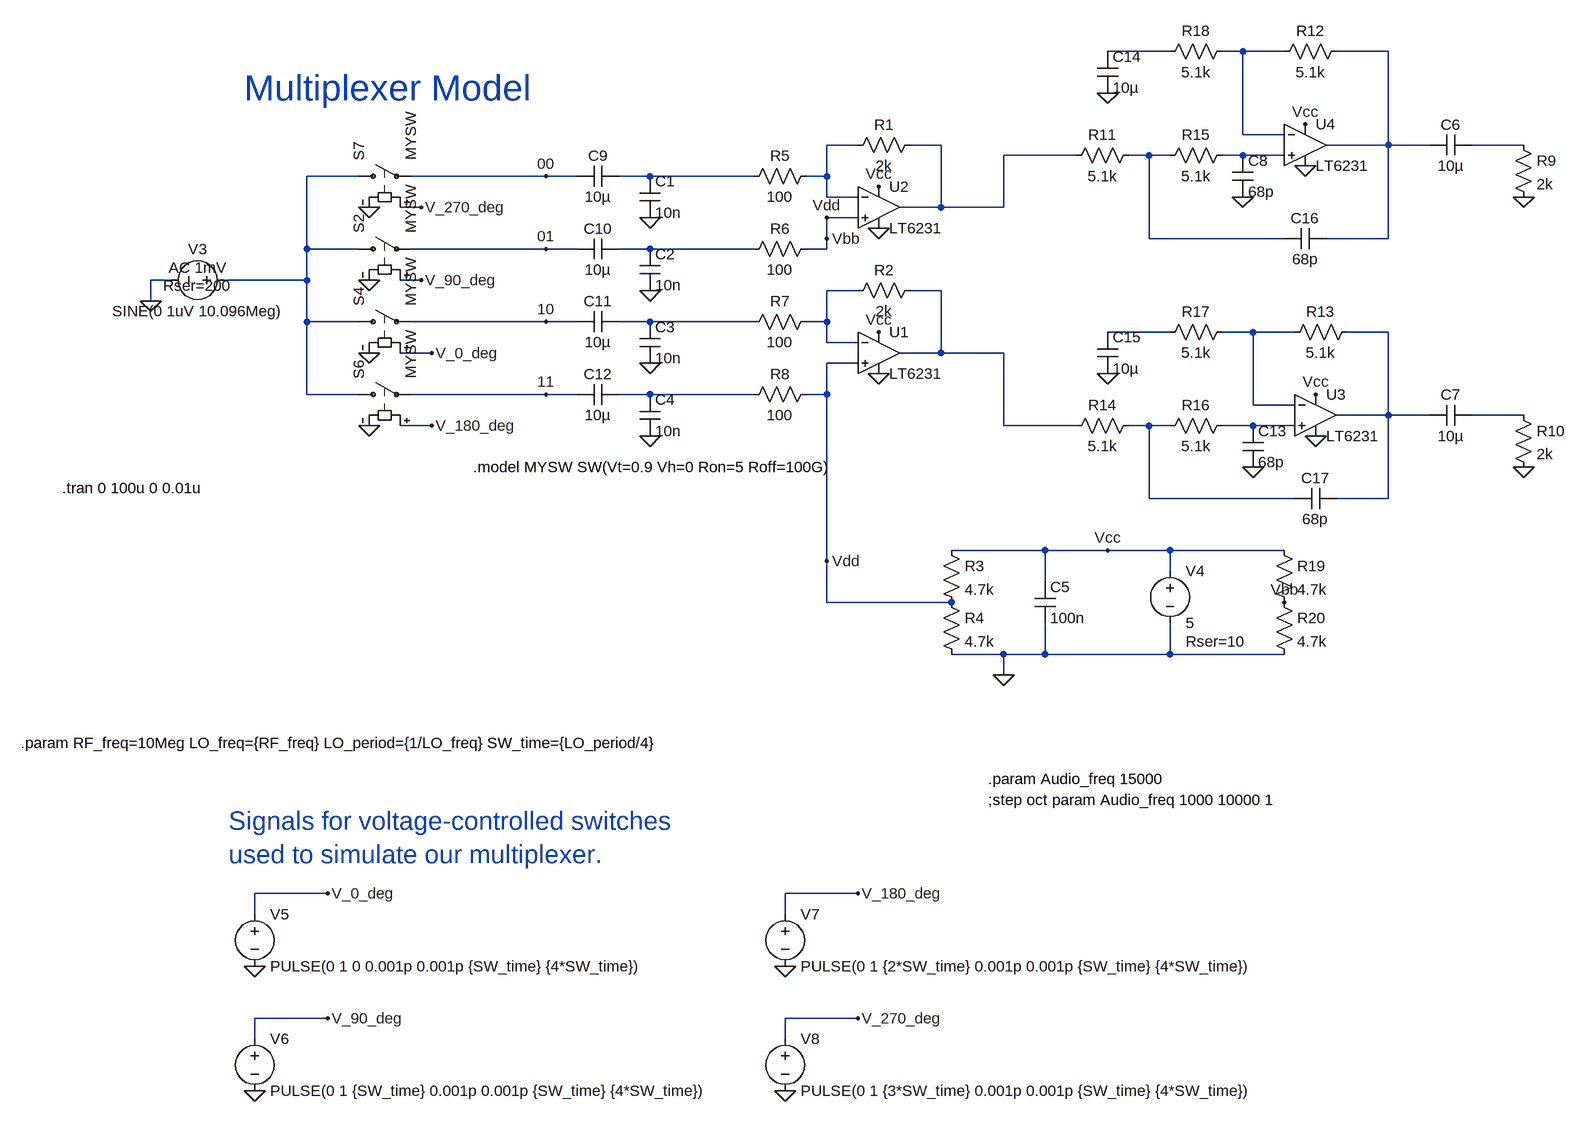
[diagram p0: schematic MUXModel_2.asc]
MUXModel_2.asc, the LTspice schematic file:
Version 4
SHEET 1 2640 932
WIRE 1376 -688 1280 -688
WIRE 1488 -688 1456 -688
WIRE 1552 -688 1488 -688
WIRE 1712 -688 1632 -688
WIRE 1488 -560 1488 -688
WIRE 1552 -560 1488 -560
WIRE 896 -544 848 -544
WIRE 1024 -544 976 -544
WIRE 1712 -544 1712 -688
WIRE 1712 -544 1616 -544
WIRE 1776 -544 1712 -544
WIRE 1920 -544 1840 -544
WIRE 1232 -528 1120 -528
WIRE 1344 -528 1312 -528
WIRE 1376 -528 1344 -528
WIRE 1488 -528 1456 -528
WIRE 1552 -528 1488 -528
WIRE 128 -496 48 -496
WIRE 416 -496 208 -496
WIRE 464 -496 416 -496
WIRE 576 -496 528 -496
WIRE 736 -496 576 -496
WIRE 848 -496 848 -544
WIRE 848 -496 816 -496
WIRE 848 -464 848 -496
WIRE 896 -464 848 -464
WIRE 224 -448 192 -448
WIRE 1024 -448 1024 -544
WIRE 1024 -448 960 -448
WIRE 1120 -448 1120 -528
WIRE 1120 -448 1024 -448
WIRE 896 -432 848 -432
WIRE 848 -400 848 -432
WIRE 1344 -400 1344 -528
WIRE 1552 -400 1344 -400
WIRE 1712 -400 1712 -544
WIRE 1712 -400 1616 -400
WIRE 48 -384 48 -496
WIRE 128 -384 48 -384
WIRE 416 -384 208 -384
WIRE 464 -384 416 -384
WIRE 576 -384 528 -384
WIRE 736 -384 576 -384
WIRE 848 -384 848 -400
WIRE 848 -384 816 -384
WIRE -160 -336 -192 -336
WIRE 48 -336 48 -384
WIRE 48 -336 -80 -336
WIRE 224 -336 192 -336
WIRE 896 -320 848 -320
WIRE 1024 -320 976 -320
WIRE -192 -304 -192 -336
WIRE 48 -272 48 -336
WIRE 128 -272 48 -272
WIRE 416 -272 208 -272
WIRE 464 -272 416 -272
WIRE 576 -272 528 -272
WIRE 736 -272 576 -272
WIRE 848 -272 848 -320
WIRE 848 -272 816 -272
WIRE 1376 -256 1280 -256
WIRE 1504 -256 1456 -256
WIRE 1568 -256 1504 -256
WIRE 1712 -256 1648 -256
WIRE 848 -240 848 -272
WIRE 896 -240 848 -240
WIRE 240 -224 192 -224
WIRE 1024 -224 1024 -320
WIRE 1024 -224 960 -224
WIRE 1120 -224 1024 -224
WIRE 896 -208 848 -208
WIRE 48 -160 48 -272
WIRE 128 -160 48 -160
WIRE 416 -160 208 -160
WIRE 464 -160 416 -160
WIRE 576 -160 528 -160
WIRE 736 -160 576 -160
WIRE 848 -160 848 -208
WIRE 848 -160 816 -160
WIRE 1504 -144 1504 -256
WIRE 1568 -144 1504 -144
WIRE 1712 -128 1712 -256
WIRE 1712 -128 1632 -128
WIRE 1776 -128 1712 -128
WIRE 1920 -128 1840 -128
WIRE 240 -112 192 -112
WIRE 1120 -112 1120 -224
WIRE 1232 -112 1120 -112
WIRE 1344 -112 1312 -112
WIRE 1376 -112 1344 -112
WIRE 1504 -112 1456 -112
WIRE 1568 -112 1504 -112
WIRE 1344 0 1344 -112
WIRE 1568 0 1344 0
WIRE 1712 0 1712 -128
WIRE 1712 0 1632 0
WIRE 1184 80 1040 80
WIRE 1280 80 1184 80
WIRE 1376 80 1280 80
WIRE 1552 80 1376 80
WIRE 848 96 848 -160
WIRE 1376 112 1376 80
WIRE 1184 128 1184 80
WIRE 848 160 848 96
WIRE 1040 160 848 160
WIRE 1120 240 1040 240
WIRE 1184 240 1184 192
WIRE 1184 240 1120 240
WIRE 1376 240 1376 192
WIRE 1376 240 1184 240
WIRE 1552 240 1376 240
WIRE 1120 272 1120 240
WIRE 80 608 -32 608
WIRE 896 608 784 608
WIRE -32 640 -32 608
WIRE 784 640 784 608
WIRE 80 800 -32 800
WIRE 896 800 784 800
WIRE -32 832 -32 800
WIRE 784 832 784 800
FLAG 144 -448 0
FLAG 144 -336 0
FLAG 144 -224 0
FLAG 144 -112 0
FLAG -192 -304 0
FLAG 416 -496 00
FLAG 416 -384 01
FLAG 416 -160 11
FLAG 416 -272 10
FLAG 576 -432 0
FLAG 576 -320 0
FLAG 576 -208 0
FLAG 576 -96 0
FLAG 928 -416 0
FLAG 928 -192 0
FLAG 1120 272 0
FLAG 1280 80 Vcc
FLAG 928 -256 Vcc
FLAG 928 -480 Vcc
FLAG 848 96 Vdd
FLAG 848 -432 Vdd
FLAG 1584 -512 0
FLAG 1600 -96 0
FLAG 1584 -576 Vcc
FLAG 1600 -160 Vcc
FLAG 1504 -48 0
FLAG 1488 -464 0
FLAG 1280 -192 0
FLAG 1280 -624 0
FLAG 1920 -48 0
FLAG 1920 -464 0
FLAG -32 720 0
FLAG 80 608 V_0_deg
FLAG -32 912 0
FLAG 80 800 V_90_deg
FLAG 784 720 0
FLAG 896 608 V_180_deg
FLAG 784 912 0
FLAG 896 800 V_270_deg
FLAG 240 -112 V_180_deg
FLAG 240 -224 V_0_deg
FLAG 224 -336 V_90_deg
FLAG 224 -448 V_270_deg
FLAG 1552 160 Vbb
FLAG 848 -400 Vbb
SYMBOL sw 112 -496 R270
SYMATTR InstName S7
SYMATTR Value MYSW
SYMBOL sw 112 -384 R270
SYMATTR InstName S2
SYMATTR Value MYSW
SYMBOL sw 112 -272 R270
SYMATTR InstName S4
SYMATTR Value MYSW
SYMBOL sw 112 -160 R270
SYMATTR InstName S6
SYMATTR Value MYSW
SYMBOL voltage -64 -336 R90
WINDOW 0 -32 56 VBottom 2
WINDOW 3 32 56 VTop 2
WINDOW 123 -4 56 VBottom 2
WINDOW 39 24 56 VBottom 2
SYMATTR InstName V3
SYMATTR Value SINE(0 1uV 10.096Meg)
SYMATTR Value2 AC 1mV
SYMATTR SpiceLine Rser=200
SYMBOL cap 560 -496 R0
SYMATTR InstName C1
SYMATTR Value 10n
SYMBOL cap 560 -384 R0
SYMATTR InstName C2
SYMATTR Value 10n
SYMBOL cap 560 -272 R0
SYMATTR InstName C3
SYMATTR Value 10n
SYMBOL cap 560 -160 R0
SYMATTR InstName C4
SYMATTR Value 10n
SYMBOL res 832 -512 R90
WINDOW 0 0 56 VBottom 2
WINDOW 3 32 56 VTop 2
SYMATTR InstName R5
SYMATTR Value 100
SYMBOL res 832 -400 R90
WINDOW 0 0 56 VBottom 2
WINDOW 3 32 56 VTop 2
SYMATTR InstName R6
SYMATTR Value 100
SYMBOL res 832 -288 R90
WINDOW 0 0 56 VBottom 2
WINDOW 3 32 56 VTop 2
SYMATTR InstName R7
SYMATTR Value 100
SYMBOL res 832 -176 R90
WINDOW 0 0 56 VBottom 2
WINDOW 3 32 56 VTop 2
SYMATTR InstName R8
SYMATTR Value 100
SYMBOL cap 528 -512 R90
WINDOW 0 0 32 VBottom 2
WINDOW 3 32 32 VTop 2
SYMATTR InstName C9
SYMATTR Value 10µ
SYMBOL cap 528 -400 R90
WINDOW 0 0 32 VBottom 2
WINDOW 3 32 32 VTop 2
SYMATTR InstName C10
SYMATTR Value 10µ
SYMBOL cap 528 -288 R90
WINDOW 0 0 32 VBottom 2
WINDOW 3 32 32 VTop 2
SYMATTR InstName C11
SYMATTR Value 10µ
SYMBOL cap 528 -176 R90
WINDOW 0 0 32 VBottom 2
WINDOW 3 32 32 VTop 2
SYMATTR InstName C12
SYMATTR Value 10µ
SYMBOL res 992 -560 R90
WINDOW 0 0 56 VBottom 2
WINDOW 3 32 56 VTop 2
SYMATTR InstName R1
SYMATTR Value 2k
SYMBOL res 992 -336 R90
WINDOW 0 0 56 VBottom 2
WINDOW 3 32 56 VTop 2
SYMATTR InstName R2
SYMATTR Value 2k
SYMBOL res 1024 64 R0
SYMATTR InstName R3
SYMATTR Value 4.7k
SYMBOL res 1024 144 R0
SYMATTR InstName R4
SYMATTR Value 4.7k
SYMBOL cap 1168 128 R0
SYMATTR InstName C5
SYMATTR Value 100n
SYMBOL voltage 1376 96 R0
WINDOW 123 0 0 Left 0
WINDOW 39 24 124 Left 2
SYMATTR SpiceLine Rser=10
SYMATTR InstName V4
SYMATTR Value 5
SYMBOL res 1328 -544 R90
WINDOW 0 0 56 VBottom 2
WINDOW 3 32 56 VTop 2
SYMATTR InstName R11
SYMATTR Value 5.1k
SYMBOL res 1648 -704 R90
WINDOW 0 0 56 VBottom 2
WINDOW 3 32 56 VTop 2
SYMATTR InstName R12
SYMATTR Value 5.1k
SYMBOL res 1664 -272 R90
WINDOW 0 0 56 VBottom 2
WINDOW 3 32 56 VTop 2
SYMATTR InstName R13
SYMATTR Value 5.1k
SYMBOL res 1328 -128 R90
WINDOW 0 0 56 VBottom 2
WINDOW 3 32 56 VTop 2
SYMATTR InstName R14
SYMATTR Value 5.1k
SYMBOL res 1472 -544 R90
WINDOW 0 0 56 VBottom 2
WINDOW 3 32 56 VTop 2
SYMATTR InstName R15
SYMATTR Value 5.1k
SYMBOL res 1472 -128 R90
WINDOW 0 0 56 VBottom 2
WINDOW 3 32 56 VTop 2
SYMATTR InstName R16
SYMATTR Value 5.1k
SYMBOL cap 1472 -528 R0
SYMATTR InstName C8
SYMATTR Value 68p
SYMBOL cap 1488 -112 R0
SYMATTR InstName C13
SYMATTR Value 68p
SYMBOL res 1472 -272 R90
WINDOW 0 0 56 VBottom 2
WINDOW 3 32 56 VTop 2
SYMATTR InstName R17
SYMATTR Value 5.1k
SYMBOL res 1472 -704 R90
WINDOW 0 0 56 VBottom 2
WINDOW 3 32 56 VTop 2
SYMATTR InstName R18
SYMATTR Value 5.1k
SYMBOL cap 1264 -688 R0
SYMATTR InstName C14
SYMATTR Value 10µ
SYMBOL cap 1264 -256 R0
SYMATTR InstName C15
SYMATTR Value 10µ
SYMBOL cap 1840 -560 R90
WINDOW 0 0 32 VBottom 2
WINDOW 3 32 32 VTop 2
SYMATTR InstName C6
SYMATTR Value 10µ
SYMBOL cap 1840 -144 R90
WINDOW 0 0 32 VBottom 2
WINDOW 3 32 32 VTop 2
SYMATTR InstName C7
SYMATTR Value 10µ
SYMBOL res 1904 -560 R0
SYMATTR InstName R9
SYMATTR Value 2k
SYMBOL res 1904 -144 R0
SYMATTR InstName R10
SYMATTR Value 2k
SYMBOL cap 1616 -416 R90
WINDOW 0 0 32 VBottom 2
WINDOW 3 32 32 VTop 2
SYMATTR InstName C16
SYMATTR Value 68p
SYMBOL cap 1632 -16 R90
WINDOW 0 0 32 VBottom 2
WINDOW 3 32 32 VTop 2
SYMATTR InstName C17
SYMATTR Value 68p
SYMBOL voltage -32 624 R0
WINDOW 123 0 0 Left 0
WINDOW 39 0 0 Left 0
SYMATTR InstName V5
SYMATTR Value PULSE(0 1 0 0.001p 0.001p {SW_time} {4*SW_time})
SYMBOL voltage -32 816 R0
WINDOW 123 0 0 Left 0
WINDOW 39 0 0 Left 0
SYMATTR InstName V6
SYMATTR Value PULSE(0 1 {SW_time} 0.001p 0.001p {SW_time} {4*SW_time})
SYMBOL voltage 784 624 R0
WINDOW 123 0 0 Left 0
WINDOW 39 0 0 Left 0
SYMATTR InstName V7
SYMATTR Value PULSE(0 1 {2*SW_time} 0.001p 0.001p {SW_time} {4*SW_time})
SYMBOL voltage 784 816 R0
WINDOW 123 0 0 Left 0
WINDOW 39 0 0 Left 0
SYMATTR InstName V8
SYMATTR Value PULSE(0 1 {3*SW_time} 0.001p 0.001p {SW_time} {4*SW_time})
SYMBOL OpAmps\\LT6231 1600 -128 R0
SYMATTR InstName U3
SYMBOL OpAmps\\LT6231 1584 -544 R0
SYMATTR InstName U4
SYMBOL OpAmps\\LT6231 928 -224 R0
SYMATTR InstName U1
SYMBOL OpAmps\\LT6231 928 -448 R0
SYMATTR InstName U2
SYMBOL res 1536 64 R0
SYMATTR InstName R19
SYMATTR Value 4.7k
SYMBOL res 1536 144 R0
SYMATTR InstName R20
SYMATTR Value 4.7k
TEXT 304 -48 Left 2 !.model MYSW SW(Vt=0.9 Vh=0 Ron=5 Roff=100G)
TEXT -328 -16 Left 2 !.tran 0 100u 0 0.01u
TEXT -48 -632 Left 5 ;Multiplexer Model
TEXT -72 496 Left 4 ;Signals for voltage-controlled switches \nused to simulate our multiplexer.
TEXT 1096 464 Left 2 !;step oct param Audio_freq 1000 10000 1
TEXT 1096 432 Left 2 !.param Audio_freq 15000
TEXT -392 376 Left 2 !.param RF_freq=10Meg LO_freq={RF_freq} LO_period={1/LO_freq} SW_time={LO_period/4}

The netlist it stands for:
* MUXModel_2.asc
S7 N009 00 V_270_deg 0 MYSW
S2 N009 01 V_90_deg 0 MYSW
S4 N009 10 V_0_deg 0 MYSW
S6 N009 11 V_180_deg 0 MYSW
V3 N009 0 SINE(0 1uV 10.096Meg) AC 1mV Rser=200
C1 N010 0 10n
C2 N011 0 10n
C3 N014 0 10n
C4 N018 0 10n
R5 N004 N010 100
R6 Vbb N011 100
R7 N012 N014 100
R8 Vbb N018 100
C9 N010 00 10µ
C10 N011 01 10µ
C11 N014 10 10µ
C12 N018 11 10µ
R1 N005 N004 2k
R2 N013 N012 2k
R3 Vcc Vbb 4.7k
R4 Vbb 0 4.7k
C5 Vcc 0 100n
V4 Vcc 0 5 Rser=10
R11 N007 N005 5.1k
R12 N003 N002 5.1k
R13 N017 N016 5.1k
R14 N020 N013 5.1k
R15 N008 N007 5.1k
R16 N021 N020 5.1k
C8 N008 0 68p
C13 N021 0 68p
R17 N016 N015 5.1k
R18 N002 N001 5.1k
C14 N001 0 10µ
C15 N015 0 10µ
C6 N006 N003 10µ
C7 N019 N017 10µ
R9 N006 0 2k
R10 N019 0 2k
C16 N003 N007 68p
C17 N017 N020 68p
V5 V_0_deg 0 PULSE(0 1 0 0.001p 0.001p {SW_time} {4*SW_time})
V6 V_90_deg 0 PULSE(0 1 {SW_time} 0.001p 0.001p {SW_time} {4*SW_time})
V7 V_180_deg 0 PULSE(0 1 {2*SW_time} 0.001p 0.001p {SW_time} {4*SW_time})
V8 V_270_deg 0 PULSE(0 1 {3*SW_time} 0.001p 0.001p {SW_time} {4*SW_time})
XU3 N021 N016 N017 Vcc 0 LT6231  ; pins In+ In- OUT V+ V-
XU4 N008 N002 N003 Vcc 0 LT6231  ; pins In+ In- OUT V+ V-
XU1 Vbb N012 N013 Vcc 0 LT6231  ; pins In+ In- OUT V+ V-
XU2 Vbb N004 N005 Vcc 0 LT6231  ; pins In+ In- OUT V+ V-
R19 Vcc Vbb 4.7k
R20 Vbb 0 4.7k
.model MYSW SW(Vt=0.9 Vh=0 Ron=5 Roff=100G)
.tran 0 100u 0 0.01u
* Multiplexer Model
* Signals for voltage-controlled switches
* used to simulate our multiplexer.
;step oct param Audio_freq 1000 10000 1
.param Audio_freq 15000
.param RF_freq=10Meg LO_freq={RF_freq} LO_period={1/LO_freq} SW_time={LO_period/4}
.lib LTC2.lib
.backanno
.end